# EAGLE schematic HW2 (EAGLE 7.5.0)
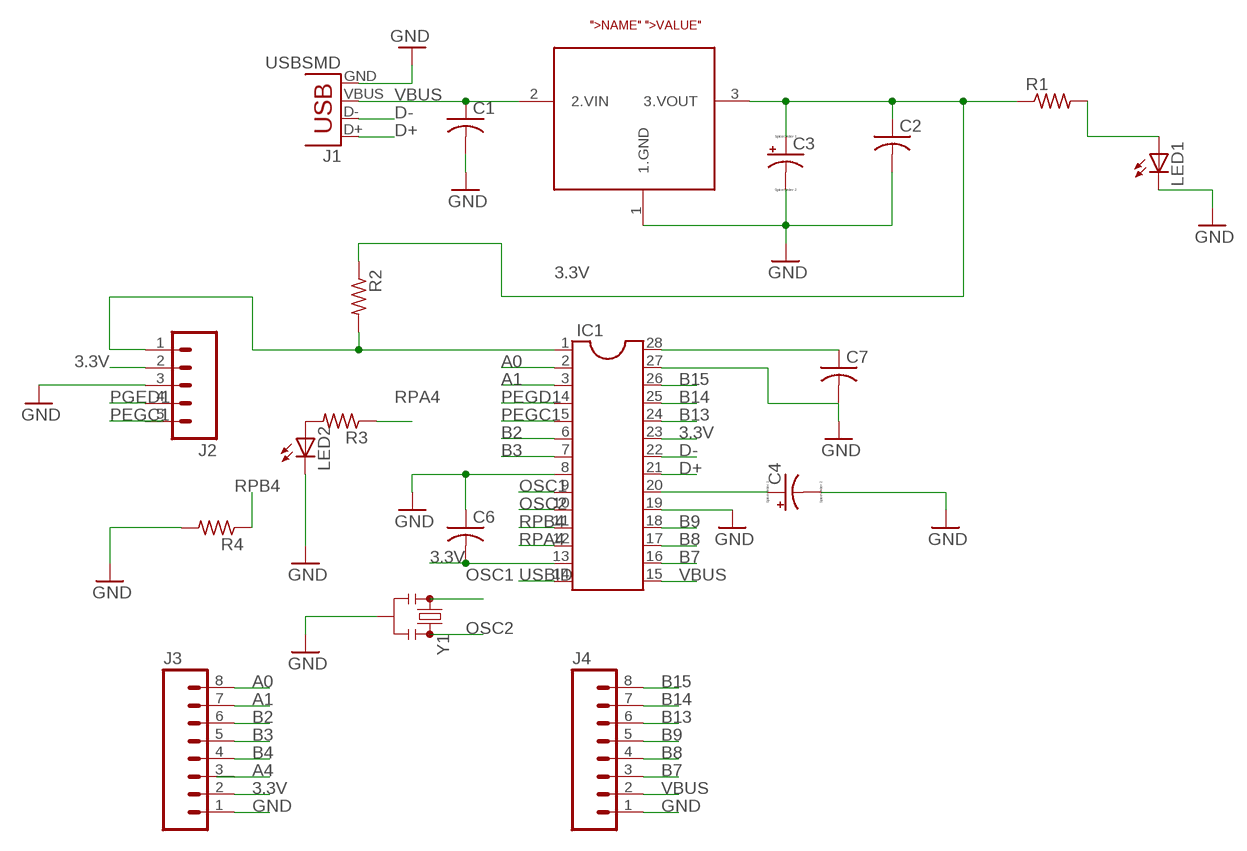
[diagram p0: schematic, sheet 1]

## Parts
C1  C-US050-024X044  [C050-024X044]
C2  C-US050-024X044  [C050-024X044]
C3  CPOL-USE2-5  [E2-5]
C4  CPOL-USE2-5  [E2-5]
C6  C-US050-024X044  [C050-024X044]
C7  C-US050-024X044  [C050-024X044]
IC1  DIL28-4  [DIL28-4]
J1  USBSMD  [USB-MINIB]
J2  M05JST  [JST-5-PTH]
J3  M08NO_SILK_FEMALE_PTH  [1X08_NO_SILK]
J4  M08NO_SILK_FEMALE_PTH  [1X08_NO_SILK]
LED1  LED3MM  [LED3MM]
LED2  LED3MM  [LED3MM]
R1  R-US_0207/10  [0207/10]
R2  R-US_0207/10  [0207/10]
R3  R-US_0207/10  [0207/10]
R4  R-US_0207/10  [0207/10]
U$1  MCP1702  [TO92]
Y1  RESONATORPTH  [RESONATOR-PTH]

## Nets
3.3V: C2.1 C3.+ C6.2 C7.1 IC1.13 IC1.23 IC1.28 J2.2 J3.2 R1.1 R2.1 U$1.3(3.VOUT)
A0: IC1.2 J3.8
A1: IC1.3 J3.7
B2: IC1.6 J3.6
B3: IC1.7 J3.5
B4: J3.4
B7: IC1.16 J4.3
B8: IC1.17 J4.4
B9: IC1.18 J4.5
B13: IC1.24 J4.6
B14: IC1.25 J4.7
B15: IC1.26 J4.8
D+: IC1.21 J1.D+
D-: IC1.22 J1.D-
GND: C1.2 C2.2 C3.- C4.- C6.1 IC1.8 IC1.19 J1.GND J2.3 J3.1 J4.1 LED1.K(C) LED2.K(C) R4.2 U$1.1(1.GND) Y1.2
N$1: C7.2 IC1.27
N$2: LED2.A R3.2
N$3: LED1.A R1.2
N$4: IC1.1 J2.1 R2.2
N$5: C4.+ IC1.20
OSC1: IC1.9 Y1.1
OSC2: IC1.10 Y1.3
PEGC1: IC1.5
PEGD1: IC1.4
PGED1: J2.4
RPA4: IC1.12 R3.1
RPB4: IC1.11 R4.1
USBID: IC1.14
VBUS: C1.1 IC1.15 J1.VBUS J4.2 U$1.2(2.VIN)
Unconnected: J2.5 J3.3

## Library data of the parts
C1 C2 C6 C7 = PIC32:C-US: CAPACITOR, American symbol
C3 C4 = PIC32:CPOL-US: POLARIZED CAPACITOR, American symbol
IC1 = PIC32:DIL28: Dual In Line
J1 = PIC32:USB: USB Connectors USB-B-PTH is fully proven SKU : PRT-00139/CONN-08278 USB-miniB is fully proven SKU : PRT-00587 USB-A-PCB is untested. USB-A-H is throughly reviewed, but untested. Spark Fun Electronics SKU : PRT-00437 USB-B-SMT is throughly reviewed, but untested. Needs silkscreen touching up. USB-A-S has not been used/tested USB-MB-H has not been used/tested USB-MICROB has been used. CONN-09505; PROD_ID: CONN-08193
J2 = PIC32:M05: Header 5 Standard 5-pin 0.1" header. Use with straight break away headers (SKU : PRT-00116), right angle break away headers (PRT-00553), swiss pins (PRT-00743), machine pins (PRT-00117), and female headers (PRT-00115). Molex polarized connector foot print use with SKU : PRT-08230 with associated crimp pins and housings.
J3 J4 = PIC32:M08: Header 8 Standard 8-pin 0.1" header. Use with straight break away headers (SKU : PRT-00116), right angle break away headers (PRT-00553), swiss pins (PRT-00743), machine pins (PRT-00117), and female headers (PRT-00115).; PROD_ID: CONN-08438
LED1 LED2 = PIC32:LED: LED OSRAM: - CHIPLED LG R971, LG N971, LY N971, LG Q971, LY Q971, LO R971, LY R971 LH N974, LH R974 LS Q976, LO Q976, LY Q976 LO Q996 - Hyper CHIPLED LW Q18S LB Q993, LB Q99A, LB R99A - SideLED LS A670, LO A670, LY A670, LG A670, LP A670 LB A673, LV A673, LT A673, LW A673 LH A674 LY A675 LS A676, LA A676, LO A676, LY A676, LW A676 LS A679, LY A679, LG A679 - Hyper Micro SIDELED® LS Y876, LA Y876, LO Y876, LY Y876 LT Y87S - SmartLED LW L88C, LW L88S LB L89C, LB L89S, LG L890 LS L89K, LO L89K, LY L89K LS L896, LA L896, LO L896, LY L896 - TOPLED LS T670, LO T670, LY T670, LG T670, LP T670 LSG T670, LSP T670, LSY T670, LOP T670, LYG T670 LG T671, LOG T671, LSG T671 LB T673, LV T673, LT T673, LW T673 LH T674 LS T676, LA T676, LO T676, LY T676, LB T676, LH T676, LSB T676, LW T676 LB T67C, LV T67C, LT T67C, LS T67K, LO T67K, LY T67K, LW E67C LS E67B, LA E67B, LO E67B, LY E67B, LB E67C, LV E67C, LT E67C LW T67C LS T679, LY T679, LG T679 LS T770, LO T770, LY T770, LG T770, LP T770 LB T773, LV T773, LT T773, LW T773 LH T774 LS E675, LA E675, LY E675, LS T675 LS T776, LA T776, LO T776, LY T776, LB T776 LHGB T686 LT T68C, LB T68C - Hyper Mini TOPLED® LB M676 - Mini TOPLED Santana® LG M470 LS M47K, LO M47K, LY M47K Source: http://www.osram.convergy.de LUXEON: - LUMILED® LXK2-PW12-R00, LXK2-PW12-S00, LXK2-PW14-U00, LXK2-PW14-V00 LXK2-PM12-R00, LXK2-PM12-S00, LXK2-PM14-U00 LXK2-PE12-Q00, LXK2-PE12-R00, LXK2-PE12-S00, LXK2-PE14-T00, LXK2-PE14-U00 LXK2-PB12-K00, LXK2-PB12-L00, LXK2-PB12-M00, LXK2-PB14-N00, LXK2-PB14-P00, LXK2-PB14-Q00 LXK2-PR12-L00, LXK2-PR12-M00, LXK2-PR14-Q00, LXK2-PR14-R00 LXK2-PD12-Q00, LXK2-PD12-R00, LXK2-PD12-S00 LXK2-PH12-R00, LXK2-PH12-S00 LXK2-PL12-P00, LXK2-PL12-Q00, LXK2-PL12-R00 Source: www.luxeon.com KINGBRIGHT: KA-3528ASYC Source: www.kingbright.com
R1-R4 = PIC32:R-US_: RESISTOR, American symbol
U$1 = PIC32:MCP1702
Y1 = PIC32:RESONATOR: Resonator Small SMD resonator. Used, eg, on the Arduino Pro/ Pro Mini boards. 8MHz- XTAL-08895 16MHz- XTAL-08900